# Altium schematic sheet esp32s3.SchDoc
size A3; SheetNumber: 1; SheetTotal: 2
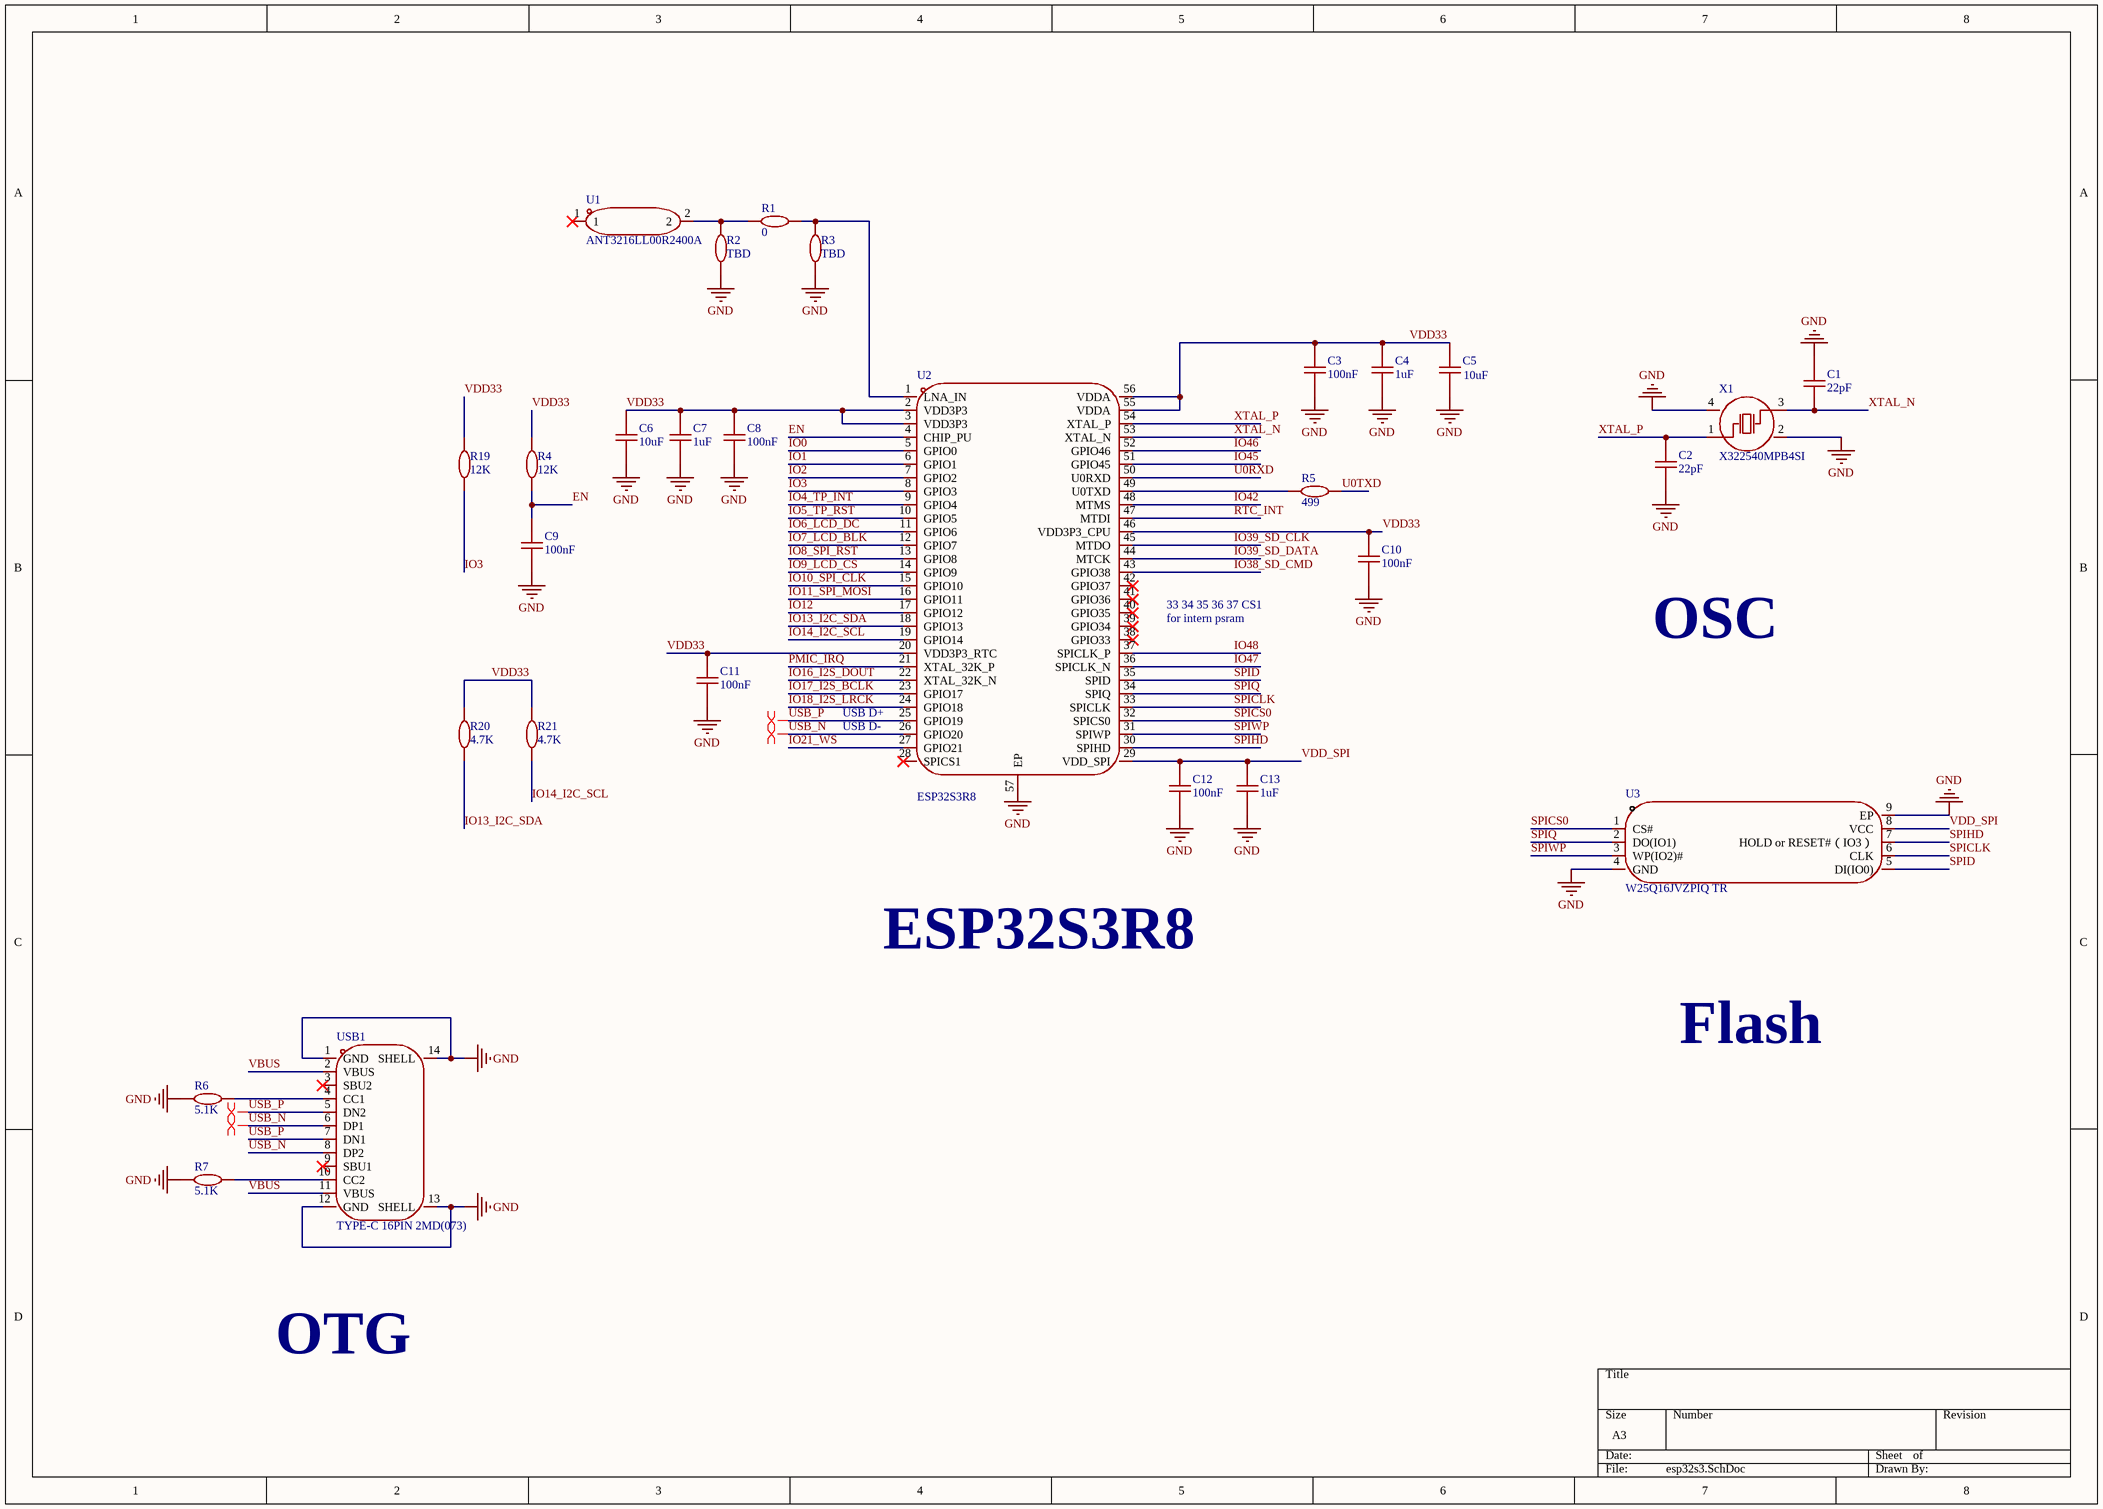
[diagram p0: esp32s3.SchDoc]

## Parts
C1  22pF  [C0402]
C2  22pF  [C0402]
C3  100nF  [C0402]
C4  1uF  [C0402]
C5  10uF  [C0603]
C6  10uF  [C0603]
C7  1uF  [C0402]
C8  100nF  [C0402]
C9  100nF  [C0402]
C10  100nF  [C0402]
C11  100nF  [C0402]
C12  100nF  [C0402]
C13  1uF  [C0402]
R1  0  [R0402]
R2  TBD  [R0402]
R3  TBD  [R0402]
R4  12K  [R0402]
R5  499  [R0402]
R6  5.1K  [R0402]
R7  5.1K  [R0402]
R19  12K  [R0402]
R20  4.7K  [R0402]
R21  4.7K  [R0402]
U1  ANT3216LL00R2400A  [ANT-SMD_L3.2-W1.6]
U2  ESP32S3R8  [QFN-56_L7.0-W7.0-P0.40-TL-EP4.0]
U3  W25Q16JVZPIQ TR  [WSON-8_L6.0-W5.0-P1.27-BL-EP]
USB1  TYPE-C 16PIN 2MD(073)  [USB-C-SMD_TYPE-C-6PIN-2MD-073]
X1  X322540MPB4SI  [OSC-SMD_4P-L3.2-W2.5-BL_SIT8008BI]

## Nets
GND: C1.2 C2.1 C3.1 C4.1 C5.1 C6.1 C7.1 C8.1 C9.1 C10.1 C11.1 C12.1 C13.1 R2.1 R3.1 R6.2 R7.2 U2.57(EP) U3.4(GND) U3.9(EP) USB1.1(GND) USB1.12(GND) USB1.13(SHELL) USB1.14(SHELL) X1.2(GND) X1.4(GND)
EN: C9.2 R4.1 U2.4(CHIP_PU)
IO0: U2.5(GPIO0)
IO1: U2.6(GPIO1)
IO2: U2.7(GPIO2)
IO3: R19.1 U2.8(GPIO3)
IO4_TP_INT: U2.9(GPIO4)
IO5_TP_RST: U2.10(GPIO5)
IO6_LCD_DC: U2.11(GPIO6)
IO7_LCD_BLK: U2.12(GPIO7)
IO8_SPI_RST: U2.13(GPIO8)
IO9_LCD_CS: U2.14(GPIO9)
IO10_SPI_CLK: U2.15(GPIO10)
IO11_SPI_MOSI: U2.16(GPIO11)
IO12: U2.17(GPIO12)
IO13_I2C_SDA: R20.1 U2.18(GPIO13)
IO14_I2C_SCL: R21.1 U2.19(GPIO14)
IO16_I2S_DOUT: U2.22(XTAL_32K_N)
IO17_I2S_BCLK: U2.23(GPIO17)
IO18_I2S_LRCK: U2.24(GPIO18)
IO21_WS: U2.27(GPIO21)
IO38_SD_CMD: U2.43(GPIO38)
IO39_SD_CLK: U2.45(MTDO)
IO39_SD_DATA: U2.44(MTCK)
IO42: U2.48(MTMS)
IO45: U2.51(GPIO45)
IO46: U2.52(GPIO46)
IO47: U2.36(SPICLK_N)
IO48: U2.37(SPICLK_P)
PMIC_IRQ: U2.21(XTAL_32K_P)
RTC_INT: U2.47(MTDI)
SPICLK: U2.33(SPICLK) U3.6(CLK)
SPICS0: U2.32(SPICS0) U3.1(CS#)
SPID: U2.35(SPID) U3.5(DI(IO0))
SPIHD: U2.30(SPIHD) U3.7(HOLD_or_RESET#（IO3）)
SPIQ: U2.34(SPIQ) U3.2(DO(IO1))
SPIWP: U2.31(SPIWP) U3.3(WP(IO2)#)
U0RXD: U2.50(U0RXD)
U0TXD: R5.2
USB_N: U2.26(GPIO20) USB1.6(DP1) USB1.8(DP2)
USB_P: U2.25(GPIO19) USB1.5(DN2) USB1.7(DN1)
VBUS: USB1.2(VBUS) USB1.11(VBUS)
VDD33: C3.2 C4.2 C5.2 C6.2 C7.2 C8.2 C10.2 C11.2 R4.2 R19.2 R20.2 R21.2 U2.2(VDD3P3) U2.3(VDD3P3) U2.20(VDD3P3_RTC) U2.46(VDD3P3_CPU) U2.55(VDDA) U2.56(VDDA)
VDD_SPI: C12.2 C13.2 U2.29(VDD_SPI) U3.8(VCC)
XTAL_N: C1.1 U2.53(XTAL_N) X1.3(OSC2)
XTAL_P: C2.2 U2.54(XTAL_P) X1.1(OSC1)
NetR1_1: R1.1 R2.2 U1.2
NetR1_2: R1.2 R3.2 U2.1(LNA_IN)
NetR5_1: R5.1 U2.49(U0TXD)
NetR6_1: R6.1 USB1.4(CC1)
NetR7_1: R7.1 USB1.10(CC2)

Not connected (* = marked no-connect by the designer): U1 1*; U2 28(SPICS1)* 38(GPIO33)* 39(GPIO34)* 40(GPIO35)* 41(GPIO36)* 42(GPIO37)*; USB1 3(SBU2)* 9(SBU1)*

## Layout directives
differential pair: USB_N, USB_P

## Notes on the sheet
- (near U2) 33 34 35 36 37 CS1
- (near U2) for intern psram
- OSC
- (near U2) USB D+
- (near U2) USB D-
- ESP32S3R8
- Flash
- OTG

## Library data of the parts
C1-C4 C7-C13 = C0402
C5 C6 = C0603
R1-R7 R19-R21 = R0402